# Altium schematic sheet SLAYER_Sensors.SchDoc
size A; SheetNumber: 2; SheetTotal: 4
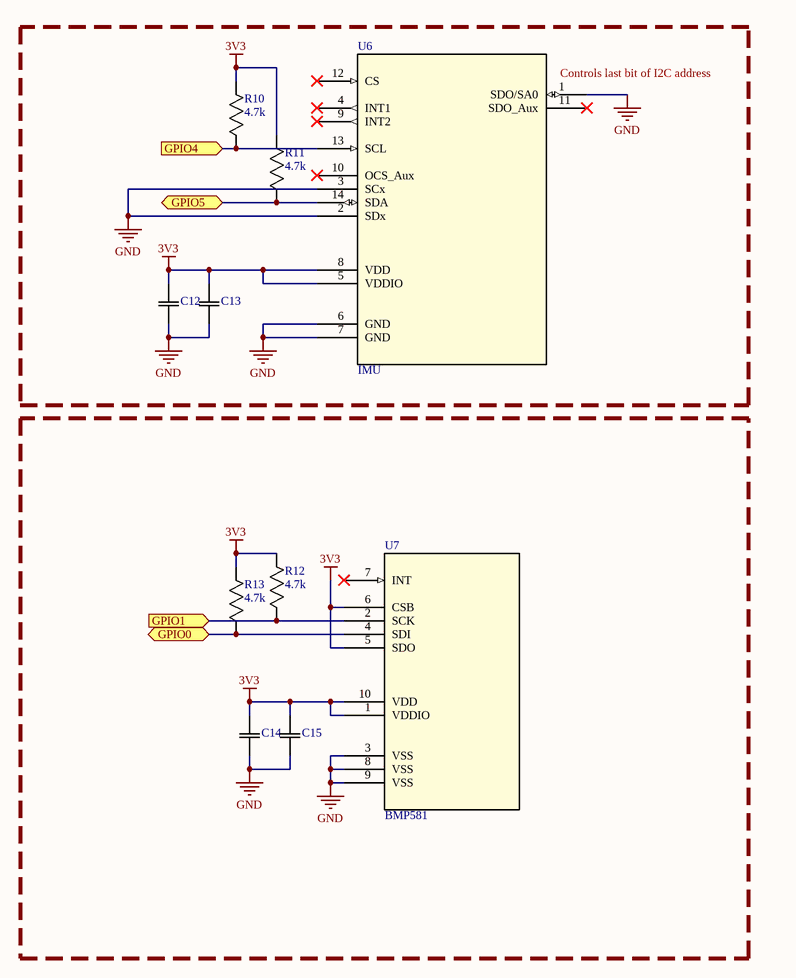
[diagram p0: SLAYER_Sensors.SchDoc]

## Parts
C12  CC0603KRX7R9BB104  [0.1uF/50V]  (value not drawn)
C13  CC0603KRX7R9BB104  [0.1uF/50V]  (value not drawn)
C14  CC0603KRX7R9BB104  [0.1uF/50V]  (value not drawn)
C15  CC0603KRX7R9BB104  [0.1uF/50V]  (value not drawn)
R10  4.7k  [4.7k/0.125W]
R11  4.7k  [4.7k/0.125W]
R12  4.7k  [4.7k/0.125W]
R13  4.7k  [4.7k/0.125W]
U6  IMU  [IMU]
U7  BMP581  [BMP581]

## Blocks framed on the sheet
Controls last bit of I2C address: C12 C13 R10 R11 U6

## Ports
GPIO0 (bidir, see SLAYER_ESP32_M1U[3A]), GPIO1 (in, see SLAYER_ESP32_M1U[3A]), GPIO4 (in, see SLAYER_ESP32_M1U[3B]), GPIO5 (bidir, see SLAYER_ESP32_M1U[3B])

## Nets
3V3: C12.2 C13.2 C14.2 C15.2 R10.1 R11.1 R12.1 R13.1 U6.5(VDDIO) U6.8(VDD) U7.1(VDDIO) U7.5(SDO) U7.6(CSB) U7.10(VDD)
GND: C12.1 C13.1 C14.1 C15.1 U6.1(SDO/SA0) U6.2(SDx) U6.3(SCx) U6.6(GND) U6.7(GND) U7.3(VSS) U7.8(VSS) U7.9(VSS)
GPIO0: R13.2 U7.4(SDI) ; port GPIO0
GPIO1: R12.2 U7.2(SCK) ; port GPIO1
GPIO4: R10.2 U6.13(SCL) ; port GPIO4
GPIO5: R11.2 U6.14(SDA) ; port GPIO5

Not connected (* = marked no-connect by the designer): U6 4(INT1)* 9(INT2)* 10(OCS_Aux)* 11(SDO_Aux)* 12(CS)*; U7 7(INT)*

## Library data of the parts
C12-C15 = 0.1uF/50V: Manufacturer_Name: Yageo; Copyright: Copyright (C) 2025 Ultra Librarian. All rights reserved.; Manufacturer_Part_Number: CC0603KRX7R9BB104
R10-R13 = 4.7k/0.125W: CRCW06034K70FKEA; Manufacturer_Name: Vishay; Copyright: Copyright (C) 2025 Ultra Librarian. All rights reserved.; Manufacturer_Part_Number: CRCW06034K70FKEA
U6 = IMU: LSM6DSMTR; Manufacturer_Name: STMicroelectronics; Copyright: Copyright (C) 2026 Ultra Librarian. All rights reserved.; Manufacturer_Part_Number: LSM6DSMTR; RefDes: RefDes; Type: Type
U7 = BMP581: Manufacturer_Name: Bosch Sensortec; Copyright: Copyright (C) 2026 Ultra Librarian. All rights reserved.; Manufacturer_Part_Number: BMP581; RefDes: RefDes; Type: Type